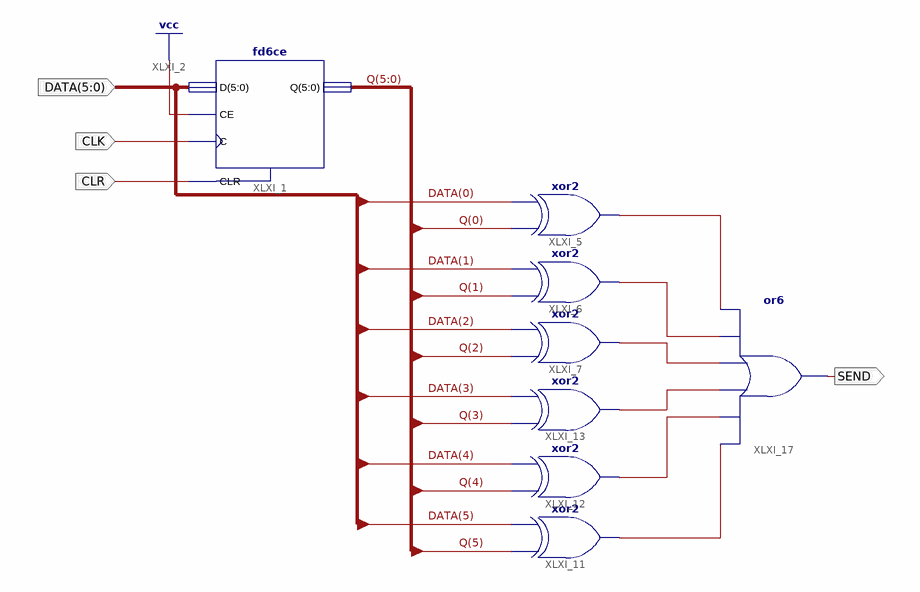
[diagram p0: schematic sheet 1]
// Xilinx ISE schematic DataChangeDetector.sch (xc9500xl) as structural Verilog: 8 symbols, 4 ports
module DataChangeDetector (
  input  [5:0] DATA,
  input  CLK,
  input  CLR,
  output SEND
);

  wire XLXN_30, XLXN_31, XLXN_32, XLXN_33, XLXN_35, XLXN_36;
  wire [5:0] Q;

  fd6ce XLXI_1 (.C(CLK), .CE(1'b1), .CLR(CLR), .D(DATA), .Q(Q));
  xor XLXI_7 (XLXN_31, Q[2], DATA[2]);
  xor XLXI_6 (XLXN_32, Q[1], DATA[1]);
  xor XLXI_5 (XLXN_33, Q[0], DATA[0]);
  xor XLXI_11 (XLXN_36, Q[5], DATA[5]);
  xor XLXI_12 (XLXN_35, Q[4], DATA[4]);
  xor XLXI_13 (XLXN_30, Q[3], DATA[3]);
  or XLXI_17 (SEND, XLXN_36, XLXN_35, XLXN_30, XLXN_31, XLXN_32, XLXN_33);
endmodule
